# Altium project STM32F413Nucleo_NT35510_PCB_Project.PrjPcb
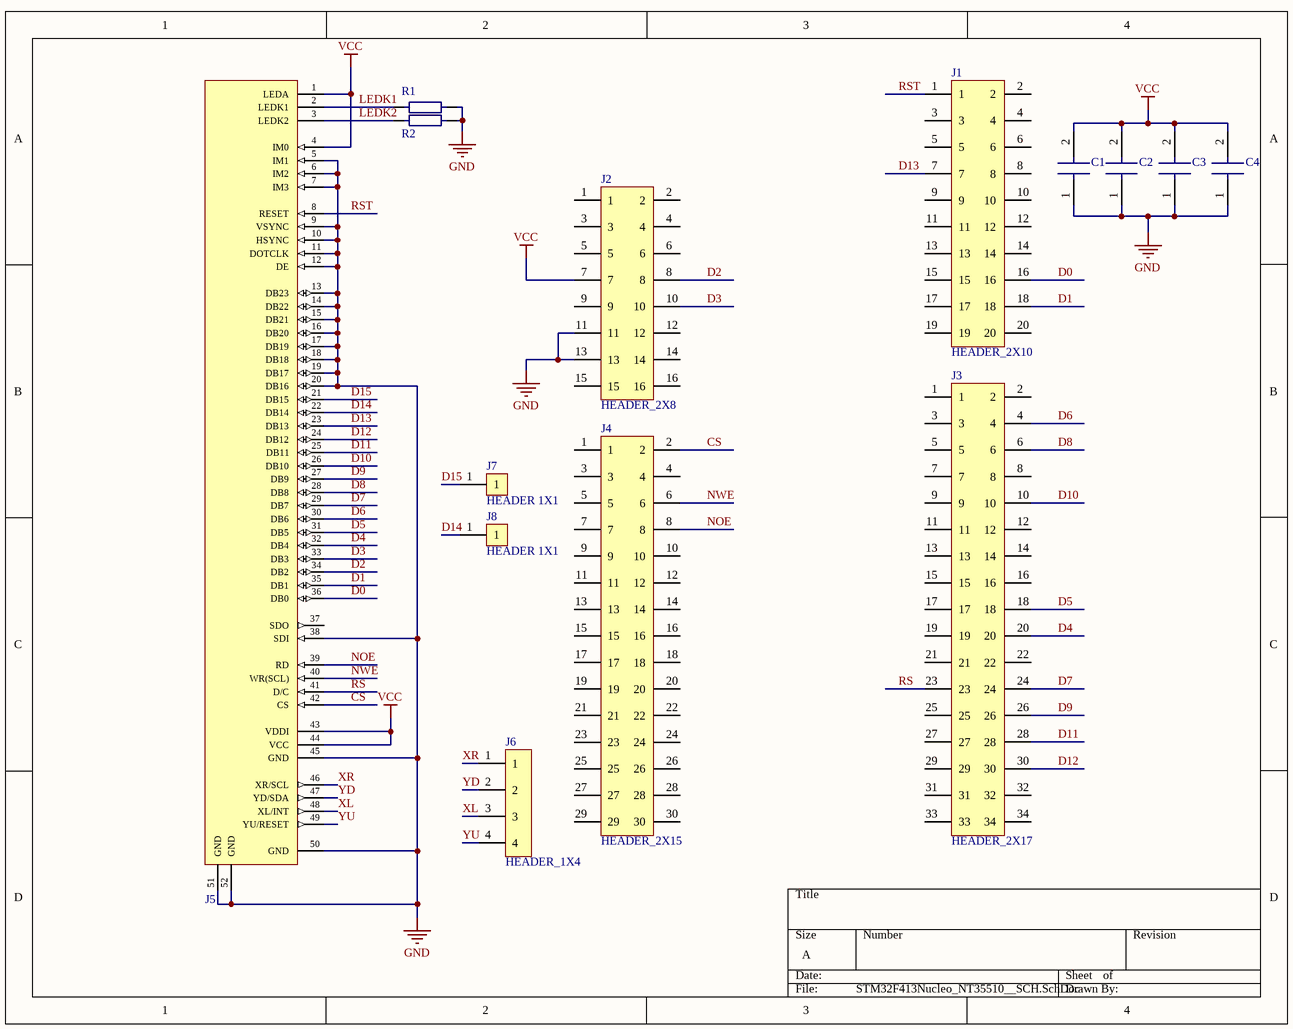
[diagram p0: STM32F413Nucleo_NT35510__SCH.SchDoc]
1 sheet, 14 parts. Net scope: global (net labels, ports and power ports of the same name join across sheets).
Board file: STM32F413Nucleo_NT35510__PCB.PcbDoc

## Sheet STM32F413Nucleo_NT35510__SCH.SchDoc
size A

### Parts
C1  Capacitor 0.1uf  [Capacitor 0805]  (value not drawn)
C2  Capacitor 10u  [Capacitor 0805]  (value not drawn)
C3  Capacitor 10u  [Capacitor 0805]  (value not drawn)
C4  Capacitor 0.1uf  [Capacitor 0805]  (value not drawn)
J1  HEADER_2X10  [HEADER_2X10]
J2  HEADER_2X8  [HEADER_2x8]
J3  HEADER_2X17  [HEADER_2X17]
J4  HEADER_2X15  [HEADER_2x15]
J5  NT35510_Controller  [ER-CON50HT-1]  (value not drawn)
J6  HEADER_1X4  [HEADER_1x4]
J7  HEADER 1X1  [HEADER_1X1]
J8  HEADER 1X1  [HEADER_1X1]
R1  Resistor 680R  [RES_0805(2012)]  (value not drawn)
R2  Resistor 680R  [RES_0805(2012)]  (value not drawn)

### Nets
GND: C1.1 C2.1 C3.1 C4.1 J2.11 J2.13 J5.5(IM1) J5.6(IM2) J5.7(IM3) J5.9(VSYNC) J5.10(HSYNC) J5.11(DOTCLK) J5.12(DE) J5.13(DB23) J5.14(DB22) J5.15(DB21) J5.16(DB20) J5.17(DB19) J5.18(DB18) J5.19(DB17) J5.20(DB16) J5.38(SDI) J5.45(GND) J5.50(GND) J5.51(GND) J5.52(GND) R1.2 R2.2
VCC: C1.2 C2.2 C3.2 C4.2 J2.7 J5.1(LEDA) J5.4(IM0) J5.43(VDDI) J5.44(VCC)
CS: J4.2 J5.42(CS)
D0: J1.16 J5.36(DB0)
D1: J1.18 J5.35(DB1)
D2: J2.8 J5.34(DB2)
D3: J2.10 J5.33(DB3)
D4: J3.20 J5.32(DB4)
D5: J3.18 J5.31(DB5)
D6: J3.4 J5.30(DB6)
D7: J3.24 J5.29(DB7)
D8: J3.6 J5.28(DB8)
D9: J3.26 J5.27(DB9)
D10: J3.10 J5.26(DB10)
D11: J3.28 J5.25(DB11)
D12: J3.30 J5.24(DB12)
D13: J1.7 J5.23(DB13)
D14: J5.22(DB14) J8.1
D15: J5.21(DB15) J7.1
LEDK1: J5.2(LEDK1) R1.1
LEDK2: J5.3(LEDK2) R2.1
NOE: J4.8 J5.39(RD)
NWE: J4.6 J5.40(WR(SCL))
RS: J3.23 J5.41(D/C)
RST: J1.1 J5.8(RESET)
XL: J5.48(XL/INT) J6.3
XR: J5.46(XR/SCL) J6.1
YD: J5.47(YD/SDA) J6.2
YU: J5.49(YU/RESET) J6.4

Not connected (* = marked no-connect by the designer): J1 2 3 4 5 6 8 9 10 11 12 13 14 15 17 19 20; J2 1 2 3 4 5 6 9 12 14 15 16; J3 1 2 3 5 7 8 9 11 12 13 14 15 16 17 19 21 22 25 27 29 31 32 33 34; J4 1 3 4 5 7 9 10 11 12 13 14 15 16 17 18 19 20 21 22 23 24 25 26 27 28 29 30; J5 37(SDO)

### Library data of the parts
J1 = HEADER_2X10: Header, Dual row, 10-Pin
J2 = HEADER_2X8: Header, Dual row, 8-Pin
J3 = HEADER_2X17: Header, Dual row, 17-Pin
J4 = HEADER_2X15: Header, Dual row, 15-Pin
J5 = NT35510_Controller: NT35510 LCD Controller
J6 = HEADER_1X4: Header, Single row, 4-Pin
J7 J8 = HEADER 1X1: Header, Single row, 1-Pin
R1 R2 = Resistor 680R: Resistor